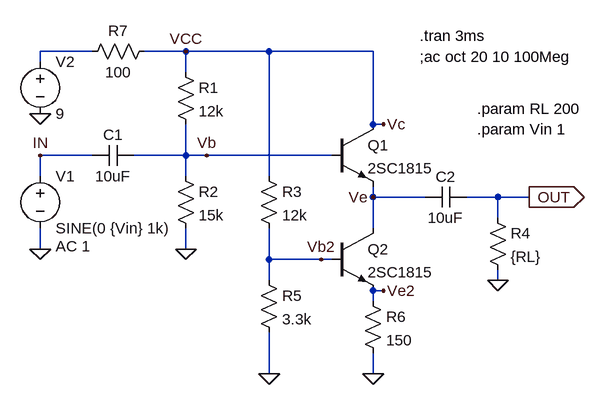
[diagram p0: schematic Emitter_Follwer_Re_ConstantCurrent_Icc.asc]
Emitter_Follwer_Re_ConstantCurrent_Icc.asc, the LTspice schematic file:
Version 4
SHEET 1 1220 680
WIRE 80 16 0 16
WIRE 224 16 160 16
WIRE 352 16 224 16
WIRE 512 16 352 16
WIRE 0 32 0 16
WIRE 224 48 224 16
WIRE 512 128 512 16
WIRE 528 128 512 128
WIRE 80 176 0 176
WIRE 224 176 224 128
WIRE 224 176 144 176
WIRE 256 176 224 176
WIRE 448 176 256 176
WIRE 0 208 0 176
WIRE 224 208 224 176
WIRE 352 208 352 16
WIRE 512 240 512 224
WIRE 592 240 512 240
WIRE 704 240 656 240
WIRE 752 240 704 240
WIRE 704 272 704 240
WIRE 512 288 512 240
WIRE 0 320 0 288
WIRE 224 320 224 288
WIRE 352 336 352 288
WIRE 432 336 352 336
WIRE 448 336 432 336
WIRE 352 368 352 336
WIRE 704 368 704 352
WIRE 528 384 512 384
WIRE 512 400 512 384
WIRE 352 512 352 448
WIRE 512 512 512 480
FLAG 0 320 0
FLAG 0 112 0
FLAG 224 320 0
FLAG 352 512 0
FLAG 752 240 OUT
IOPIN 752 240 Out
FLAG 224 16 VCC
FLAG 704 368 0
FLAG 0 176 IN
FLAG 256 176 Vb
FLAG 512 240 Ve
FLAG 528 128 Vc
FLAG 512 512 0
FLAG 528 384 Ve2
FLAG 432 336 Vb2
SYMBOL npn 448 128 R0
SYMATTR InstName Q1
SYMATTR Value 2SC1815
SYMBOL voltage 0 192 R0
WINDOW 123 24 124 Left 2
WINDOW 39 0 0 Left 2
SYMATTR Value2 AC 1
SYMATTR InstName V1
SYMATTR Value SINE(0 {Vin} 1k)
SYMBOL cap 144 160 R90
WINDOW 0 0 32 VBottom 2
WINDOW 3 32 32 VTop 2
SYMATTR InstName C1
SYMATTR Value 10uF
SYMBOL voltage 0 16 R0
WINDOW 123 0 0 Left 2
WINDOW 39 0 0 Left 2
SYMATTR InstName V2
SYMATTR Value 9
SYMBOL res 208 32 R0
SYMATTR InstName R1
SYMATTR Value 12k
SYMBOL res 208 192 R0
SYMATTR InstName R2
SYMATTR Value 15k
SYMBOL cap 656 224 R90
WINDOW 0 0 32 VBottom 2
WINDOW 3 32 32 VTop 2
SYMATTR InstName C2
SYMATTR Value 10uF
SYMBOL res 688 256 R0
SYMATTR InstName R4
SYMATTR Value {RL}
SYMBOL res 336 192 R0
SYMATTR InstName R3
SYMATTR Value 12k
SYMBOL res 336 352 R0
SYMATTR InstName R5
SYMATTR Value 3.3k
SYMBOL npn 448 288 R0
SYMATTR InstName Q2
SYMATTR Value 2SC1815
SYMBOL res 496 384 R0
SYMATTR InstName R6
SYMATTR Value 150
SYMBOL res 176 0 R90
WINDOW 0 0 56 VBottom 2
WINDOW 3 32 56 VTop 2
SYMATTR InstName R7
SYMATTR Value 100
TEXT 584 -8 Left 2 !.tran 3ms
TEXT 584 24 Left 2 !;ac oct 20 10 100Meg
TEXT 672 104 Left 2 !.param RL 200
TEXT 672 136 Left 2 !.param Vin 1

The netlist it stands for:
* Emitter_Follwer_Re_ConstantCurrent_Icc.asc
Q1 Vc Vb Ve 0 2SC1815
V1 IN 0 SINE(0 {Vin} 1k) AC 1
C1 Vb IN 10uF
V2 N001 0 9
R1 Vc Vb 12k
R2 Vb 0 15k
C2 OUT Ve 10uF
R4 OUT 0 {RL}
R3 Vc Vb2 12k
R5 Vb2 0 3.3k
Q2 Ve Vb2 Ve2 0 2SC1815
R6 Ve2 0 150
R7 Vc N001 100
.model NPN NPN
.model PNP PNP
.lib standard.bjt
.tran 3ms
;ac oct 20 10 100Meg
.param RL 200
.param Vin 1
.backanno
.end